# EAGLE design 00A-93 (EAGLE 6.3)
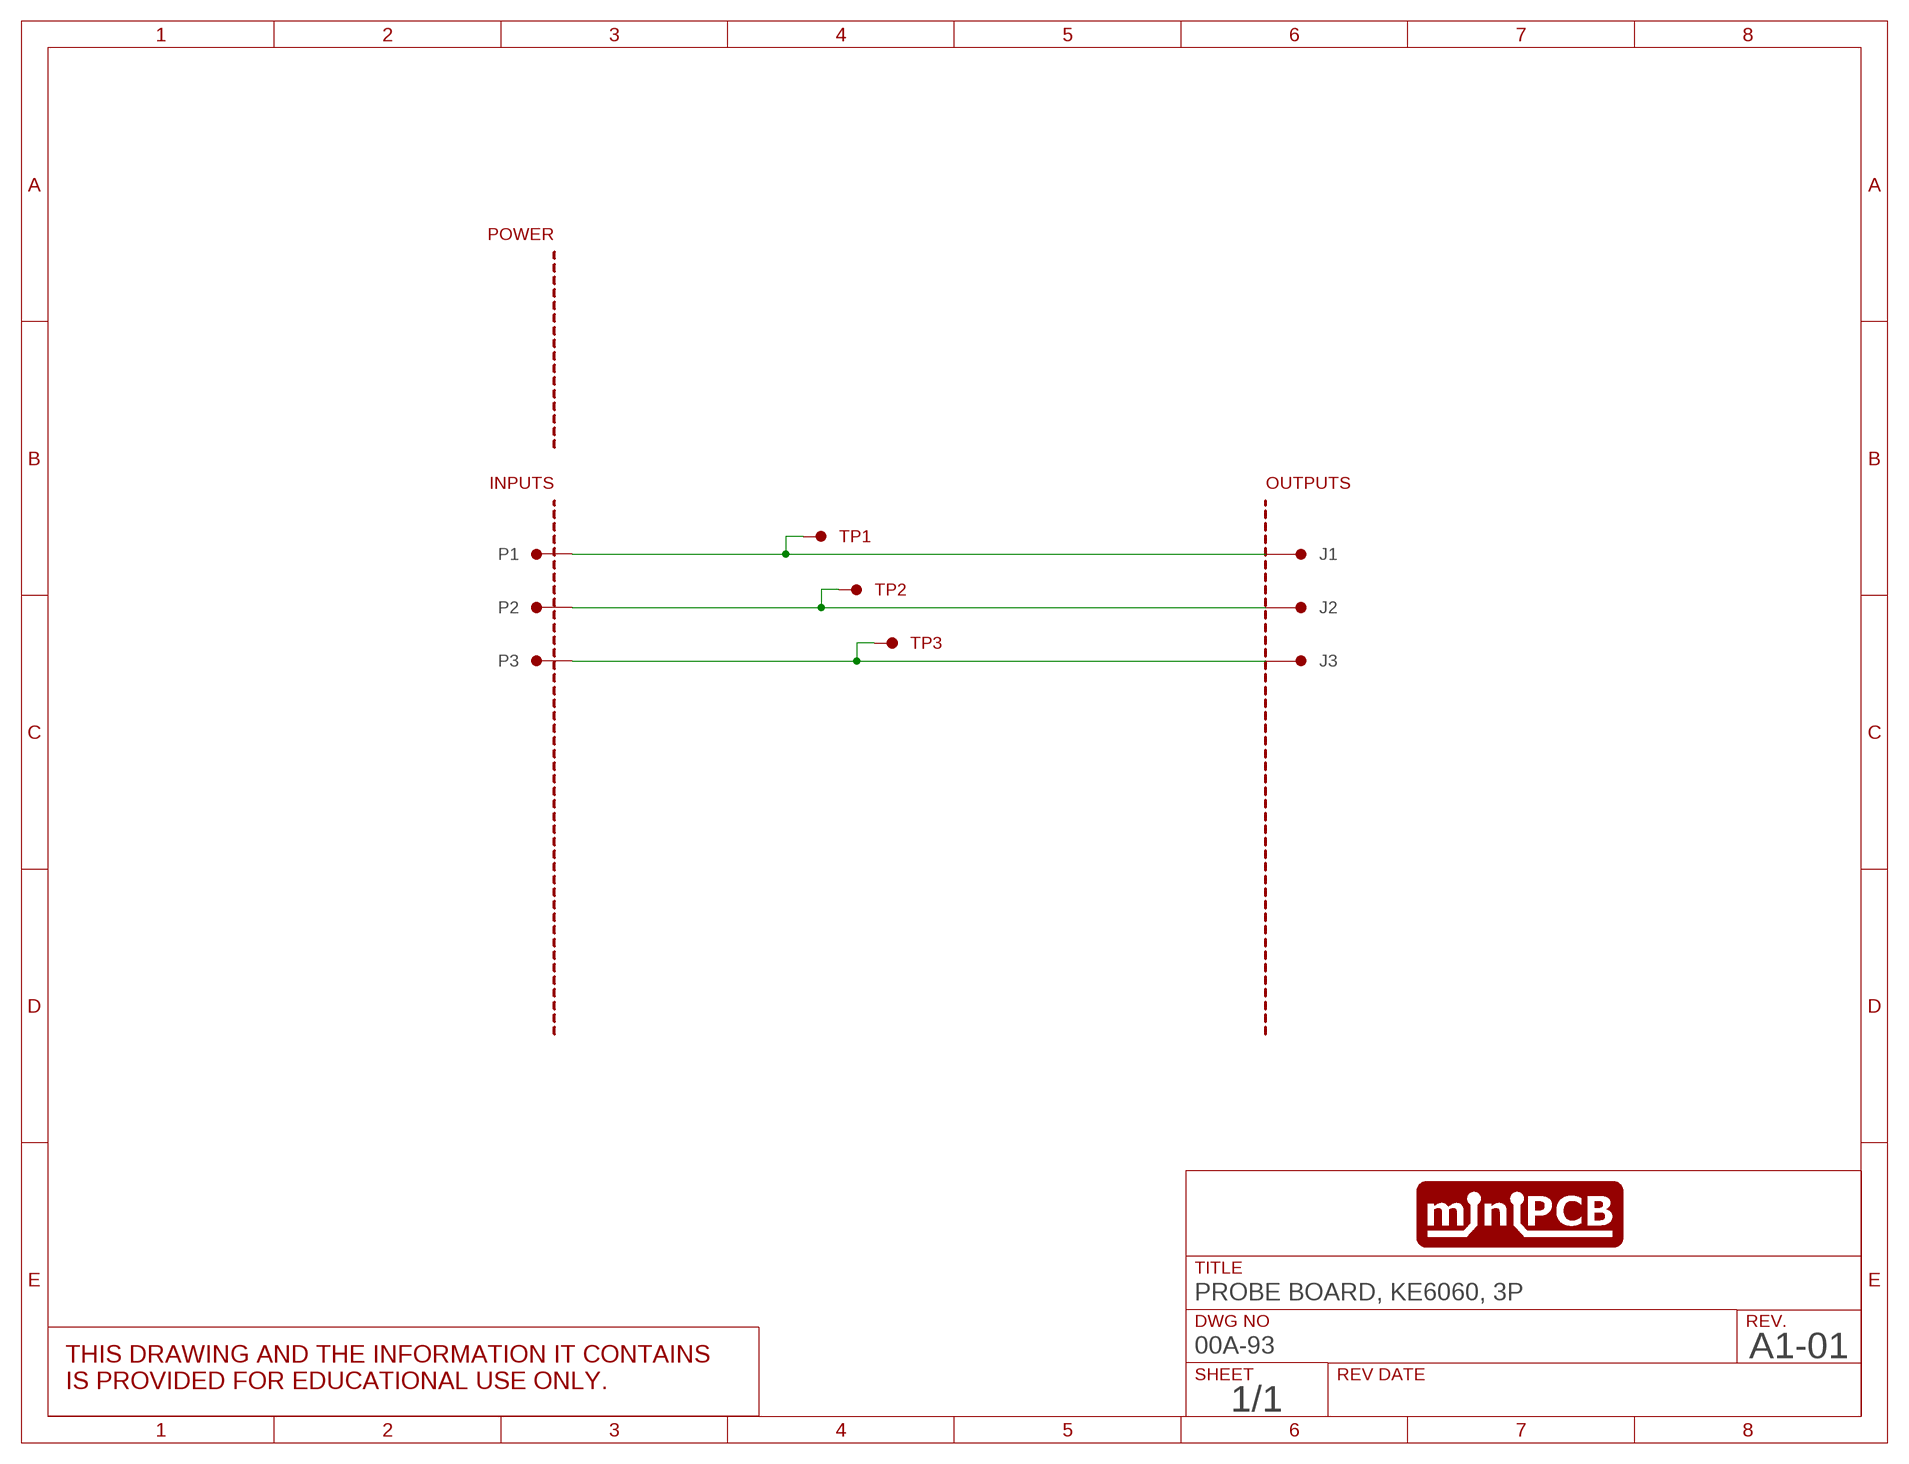
[diagram p0: schematic, sheet 1]
SHEET1 (SCHEMATIC): DWG_NO: 00A-93; REV: A1-01; TITLE: PROBE BOARD, KE6060, 3P

## Parts
J1  PINS_1KE6060  [PINS_1_KE6060]
J2  PINS_1KE6060  [PINS_1_KE6060]
J3  PINS_1KE6060  [PINS_1_KE6060]
P1  PINS_124AWG-NOTEXT  [PINS_1_1MM-NOTEXT]
P2  PINS_124AWG-NOTEXT  [PINS_1_1MM-NOTEXT]
P3  PINS_124AWG-NOTEXT  [PINS_1_1MM-NOTEXT]
PCB1  MINIPCB_0P00A-20X50  [MINIPCB_00A_20X50]
TP1  TESTPOINTKE5000-SMTEXT  [PINS_1_TESTPOINT_KE5000_NOTEXT]
TP2  TESTPOINTKE5000-SMTEXT  [PINS_1_TESTPOINT_KE5000_NOTEXT]
TP3  TESTPOINTKE5000-SMTEXT  [PINS_1_TESTPOINT_KE5000_NOTEXT]

## Nets
N$1: J1.1 J1.2 P1.1 P1.2 TP1.1
N$3: J2.1 J2.2 P2.1 P2.2 TP2.1
N$5: J3.1 J3.2 P3.1 P3.2 TP3.1

## Library data of the parts
J1-J3 P1-P3 = minipcb:PINS_1
PCB1 = minipcb:MINIPCB_0P; PART_NUMBER: 00A-93-A1-01
TP1-TP3 = minipcb:TESTPOINT

## Board
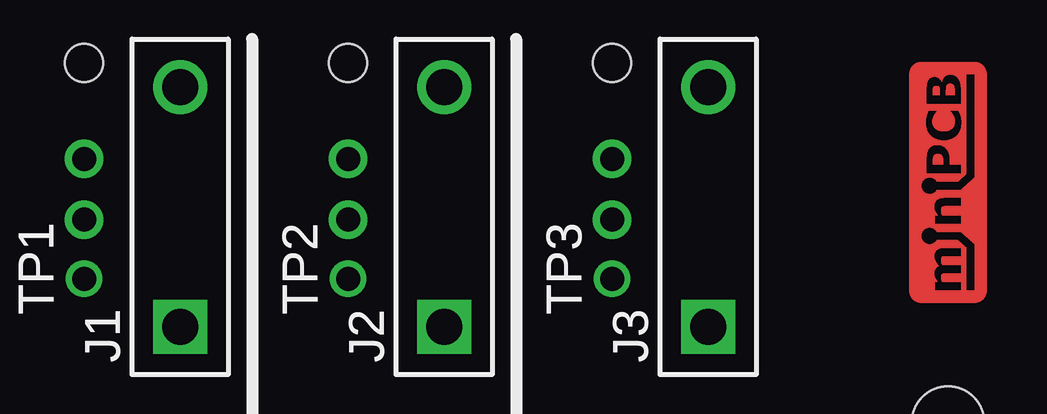
[diagram p1: board, top side]
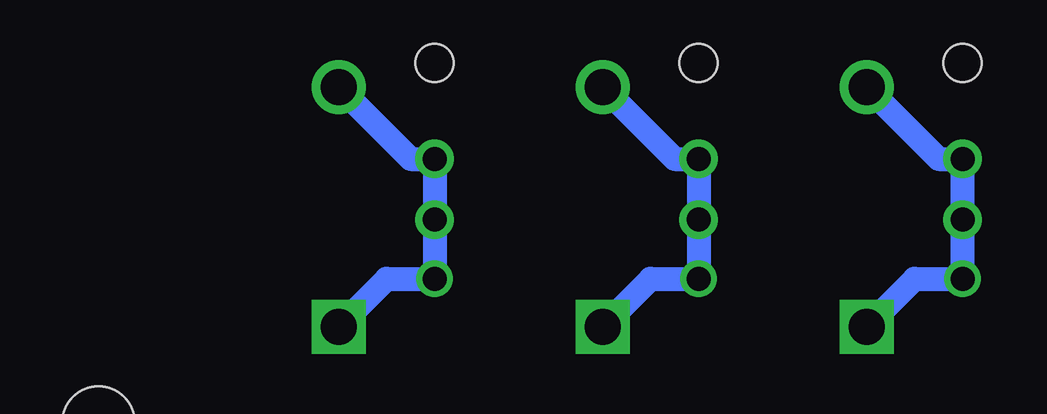
[diagram p2: board, bottom side, seen from below]

No outline drawn. Coordinates in mm, seen from the top.
Copper layers (1*16): Top 0.035mm / dielectric 1.5mm / Bottom 0.035mm
Design rules "default": minimum track width 10mil, minimum drill 0.6mm, track to track 8mil, track to pad 8mil, pad to pad 8mil, via to via 8mil, smd to smd 8mil, copper to edge 40mil, drill to drill 8mil, minimum pad ring 10mil, minimum via ring 8mil, stop-mask expansion 4mil, vias tented up to drill 0mil, thermal gap 10mil

### Footprints (pad centres in the part's own frame; a part is rotated, then mirrored left to right if it is on the bottom)
PINS_1_KE6060 = drill 1.5 square: 1 -5,0 | drill 1.5: 2 5,0
PINS_1_1MM-NOTEXT = drill 1 pad 1.6: 1 4,0; 2 6.54,0 | hole 1.6: 0,0
MINIPCB_00A_20X50 = hole 3: 47,3; 3,3
PINS_1_TESTPOINT_KE5000_NOTEXT = drill 1: 1 0,0

### Placement (x,y rotation side)
J1  15,12 90 top
J2  26,12 90 top
J3  37,12 90 top
P1  11,18 270 top
P2  22,18 270 top
P3  33,18 270 top
PCB1  0,0 0 top
TP1  11,9 90 top
TP2  22,9 90 top
TP3  33,9 90 top

### Tracks (layer width: path | path; a pad name or v marks a point on that pad's centre or on a via)
N$1
  Bottom 1: J1.2 12,14 P1.1 P1.2 TP1.1 13,9 J1.1
N$3
  Bottom 1: J2.2 23,14 P2.1 P2.2 TP2.1 24,9 J2.1
N$5
  Bottom 1: J3.2 34,14 P3.1 P3.2 TP3.1 35,9 J3.1

### Text on the board
_tNames: TP1 | TP2 | TP3 | J1 | J2 | J3